# Altium schematic sheet 底板端子对应图.SchDoc
size A3
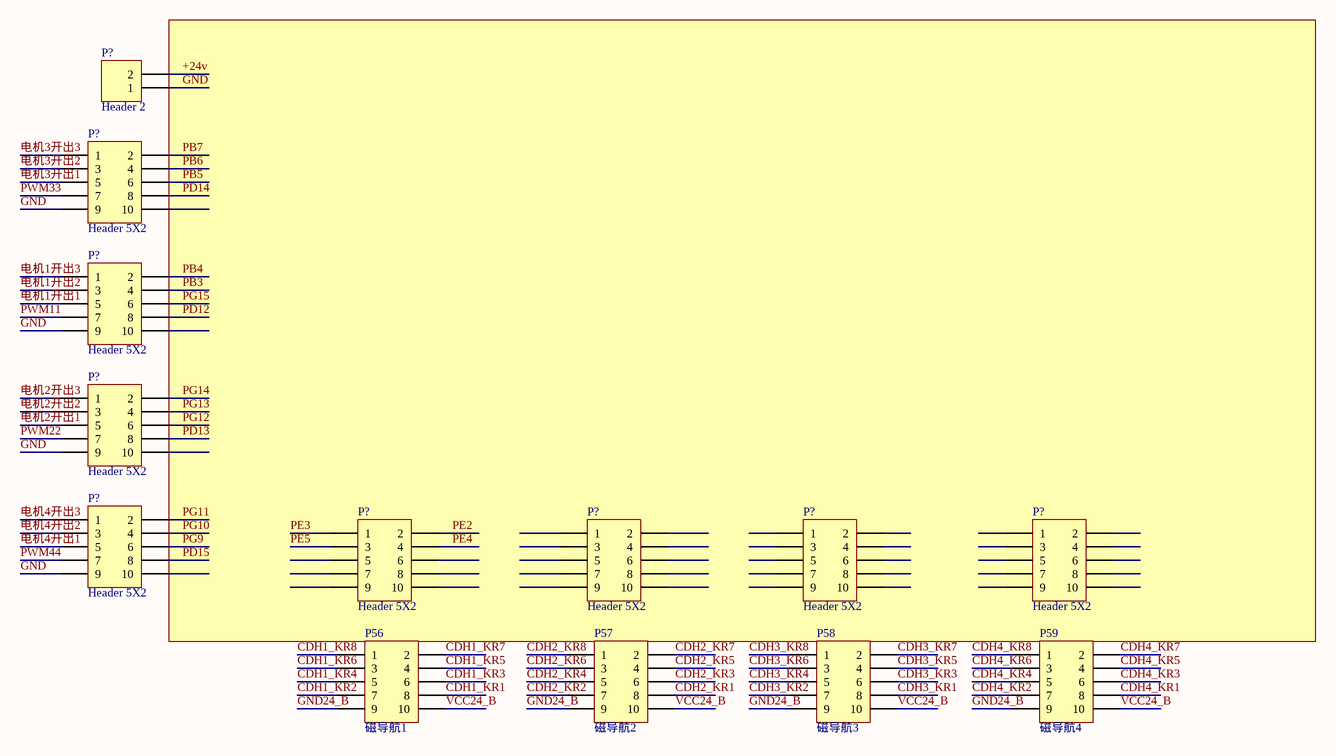
[diagram p0: 底板端子对应图.SchDoc]

## Parts
(Parts that share a designator on the sheet are numbered #1, #2 ... from top to bottom, then left to right.)
P56  磁导航1  [HDR2X5]
P57  磁导航2  [HDR2X5]
P58  磁导航3  [HDR2X5]
P59  磁导航4  [HDR2X5]
P?#1  Header 2  [HDR1X2]
P?#2  Header 5X2  [HDR2X5]
P?#3  Header 5X2  [HDR2X5]
P?#4  Header 5X2  [HDR2X5]
P?#5  Header 5X2  [HDR2X5]
P?#6  Header 5X2  [HDR2X5]
P?#7  Header 5X2  [HDR2X5]
P?#8  Header 5X2  [HDR2X5]
P?#9  Header 5X2  [HDR2X5]

## Nets
+24v: P?#1.2
CDH1_KR1: P56.8
CDH1_KR2: P56.7
CDH1_KR3: P56.6
CDH1_KR4: P56.5
CDH1_KR5: P56.4
CDH1_KR6: P56.3
CDH1_KR7: P56.2
CDH1_KR8: P56.1
CDH2_KR1: P57.8
CDH2_KR2: P57.7
CDH2_KR3: P57.6
CDH2_KR4: P57.5
CDH2_KR5: P57.4
CDH2_KR6: P57.3
CDH2_KR7: P57.2
CDH2_KR8: P57.1
CDH3_KR1: P58.8
CDH3_KR2: P58.7
CDH3_KR3: P58.6
CDH3_KR4: P58.5
CDH3_KR5: P58.4
CDH3_KR6: P58.3
CDH3_KR7: P58.2
CDH3_KR8: P58.1
CDH4_KR1: P59.8
CDH4_KR2: P59.7
CDH4_KR3: P59.6
CDH4_KR4: P59.5
CDH4_KR5: P59.4
CDH4_KR6: P59.3
CDH4_KR7: P59.2
CDH4_KR8: P59.1
GND: P?#1.1 P?#2.9 P?#3.9 P?#4.9 P?#5.9
GND24_B: P56.9 P57.9 P58.9 P59.9
PB3: P?#3.4
PB4: P?#3.2
PB5: P?#2.6
PB6: P?#2.4
PB7: P?#2.2
PD12: P?#3.8
PD13: P?#4.8
PD14: P?#2.8
PD15: P?#5.8
PE2: P?#6.2
PE3: P?#6.1
PE4: P?#6.4
PE5: P?#6.3
PG9: P?#5.6
PG10: P?#5.4
PG11: P?#5.2
PG12: P?#4.6
PG13: P?#4.4
PG14: P?#4.2
PG15: P?#3.6
PWM11: P?#3.7
PWM22: P?#4.7
PWM33: P?#2.7
PWM44: P?#5.7
VCC24_B: P56.10 P57.10 P58.10 P59.10
电机1开出1: P?#3.5
电机1开出2: P?#3.3
电机1开出3: P?#3.1
电机2开出1: P?#4.5
电机2开出2: P?#4.3
电机2开出3: P?#4.1
电机3开出1: P?#2.5
电机3开出2: P?#2.3
电机3开出3: P?#2.1
电机4开出1: P?#5.5
电机4开出2: P?#5.3
电机4开出3: P?#5.1

Not connected (* = marked no-connect by the designer): P?#2 10; P?#3 10; P?#4 10; P?#5 10; P?#6 5 6 7 8 9 10; P?#7 1 2 3 4 5 6 7 8 9 10; P?#8 1 2 3 4 5 6 7 8 9 10; P?#9 1 2 3 4 5 6 7 8 9 10

## Library data of the parts
P56-P59 = Header 5X2H: Header, 5-Pin, Dual row, Right Angle; LatestRevisionDate: 17-Jul-2002; LatestRevisionNote: Re-released for DXP Platform.; Publisher: Altium Limited
P?#1 = Header 2: Header, 2-Pin; LatestRevisionDate: 17-Jul-2002; LatestRevisionNote: Re-released for DXP Platform.; Publisher: Altium Limited
P?#2-P?#9 = Header 5X2: Header, 5-Pin, Dual row; LatestRevisionDate: 17-Jul-2002; LatestRevisionNote: Re-released for DXP Platform.; Publisher: Altium Limited